# EAGLE design OLED Display (EAGLE 9.6.2)
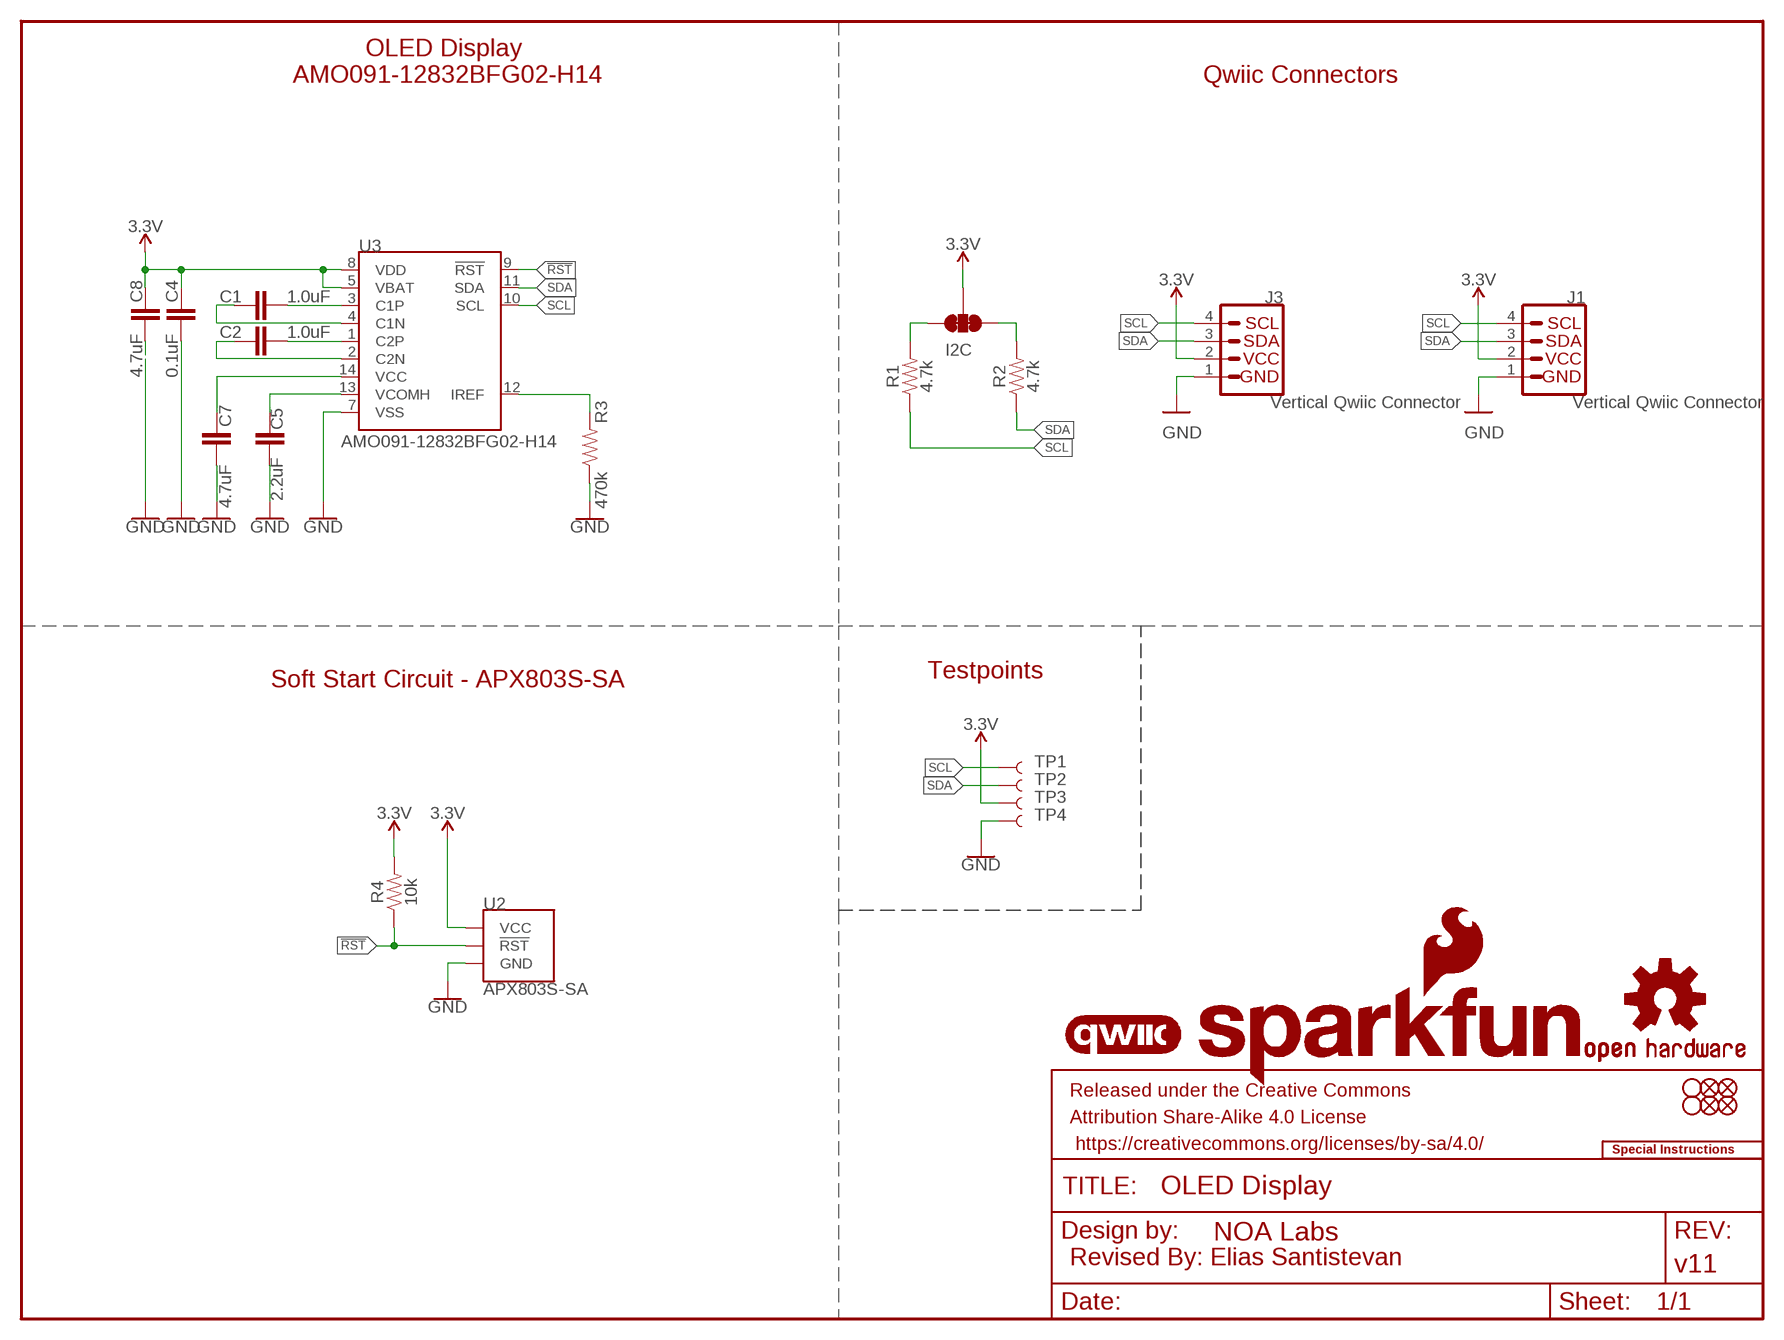
[diagram p0: schematic, sheet 1]

## Parts
C1  1.0uF  1.0UF-0603-16V-10%  [0603]
C2  1.0uF  1.0UF-0603-16V-10%  [0603]
C4  0.1uF  0.1UF-0603-25V-(+80/-20%)  [0603]
C5  2.2uF  2.2UF-0603-10V-20%  [0603]
C7  4.7uF  4.7UF-0603-6.3V-(10%)  [0603]
C8  4.7uF  4.7UF-0603-6.3V-(10%)  [0603]
FD1  FIDUCIAL1X2  [FIDUCIAL-1X2]
FD2  FIDUCIAL1X2  [FIDUCIAL-1X2]
FD3  FIDUCIAL1X2  [FIDUCIAL-1X2]
FD4  FIDUCIAL1X2  [FIDUCIAL-1X2]
FRAME2  FRAME-LETTER  [CREATIVE_COMMONS]
H1  STAND-OFFTIGHT  [STAND-OFF-TIGHT]
H2  STAND-OFFTIGHT  [STAND-OFF-TIGHT]
I2C  JUMPER-SMT_3_2-NC_TRACE_SILK  [SMT-JUMPER_3_2-NC_TRACE_SILK]
J1  Vertical Qwiic Connector  QWIIC_CONNECTOR  [JST04_1MM_VERT]
J3  Vertical Qwiic Connector  QWIIC_CONNECTOR  [JST04_1MM_VERT]
LOGO1  SFE_LOGO_NAME_FLAME.1_INCH  [SFE_LOGO_NAME_FLAME_.1]
LOGO2  OSHW-LOGOMINI  [OSHW-LOGO-MINI]
LOGO3  QWIIC_LOGO_4MM  [QWIIC_4MM]
LOGO4  SPECIAL_INSTRUCTIONS-ORDERING  [ORDERING_INSTRUCTIONS]
R1  4.7k  4.7KOHM-0603-1/10W-1%  [0603]
R2  4.7k  4.7KOHM-0603-1/10W-1%  [0603]
R3  470k  470KOHM  [0603]
R4  10k  10KOHM-0603-1/10W-1%  [0603]
TP1  TEST-POINT3X4  [PAD.03X.04]
TP2  TEST-POINT3X4  [PAD.03X.04]
TP3  TEST-POINT3X4  [PAD.03X.04]
TP4  TEST-POINT3X4  [PAD.03X.04]
U2  APX803S-SA  [SOT23-3]
U3  AMO091-12832BFG02-H14  [AMO091-12832BFG02-H14]

## Nets
3.3V: C4.1 C8.2 I2C.2 J1.2 J3.2 R4.2 TP3.1 U2.3(VCC) U3.5(VBAT) U3.8(VDD)
!RST!: R4.1 U2.2(!RST!) U3.9(!RST!)
GND: C4.2 C5.2 C7.1 C8.1 J1.1 J3.1 R3.1 TP4.1 U2.1(GND) U3.7(VSS)
N$1: C2.2 U3.1(C2P)
N$2: C1.1 U3.4(C1N)
N$4: C1.2 U3.3(C1P)
N$5: I2C.3 R1.2
N$6: C5.1 U3.13(VCOMH)
N$7: C7.2 U3.14(VCC)
N$8: I2C.1 R2.2
N$9: R3.2 U3.12(IREF)
N$17: C2.1 U3.2(C2N)
SCL: J1.4 J3.4 R1.1 TP1.1 U3.10(SCL)
SDA: J1.3 J3.3 R2.1 TP2.1 U3.11(SDA)

## Notes on the sheet
- OLED Display 
  AMO091-12832BFG02-H14
- Qwiic Connectors
- Soft Start Circuit - APX803S-SA | Testpoints
- Revised By: Elias Santistevan

## Library data of the parts
C1 C2 = SparkFun-Capacitors:1.0UF: 1µF ceramic capacitors A capacitor is a passive two-terminal electrical component used to store electrical energy temporarily in an electric field.; PROD_ID: CAP-00868
C4 = SparkFun-Capacitors:0.1UF: 0.1µF ceramic capacitors A capacitor is a passive two-terminal electrical component used to store electrical energy temporarily in an electric field.; PROD_ID: CAP-00810
C5 = SparkFun-Capacitors:2.2UF: 2.2µF ceramic capacitors A capacitor is a passive two-terminal electrical component used to store electrical energy temporarily in an electric field.; PROD_ID: CAP-07888
C7 C8 = SparkFun-Capacitors:4.7UF: 4.7µF ceramic capacitors A capacitor is a passive two-terminal electrical component used to store electrical energy temporarily in an electric field.; PROD_ID: CAP-08280
FD1-FD4 = SparkFun-Aesthetics:FIDUCIAL: Fiducial Alignment Points Point-of-reference for pick-and-place machines and other optical instruments.
FRAME2 = SparkFun-Aesthetics:FRAME-LETTER: Schematic Frame - Letter Standard 8.5x11 US Letter frame; DESIGNER: NOA Labs; REV: v11
H1 H2 = SparkFun-Hardware:STAND-OFF: Stand Off Drill holes for mechanically mounting via screws, standoffs, etc. Note: Use the keepout ring to avoid running the screw head into surrounding components. Variant Overviews STAND-OFF - Mechanical footprint for a #4 phillips button head screw. STAND-OFF-TIGHT - Mechanical footprint for a #4 phillips button head screw, Example SparkFun Products Screw - Phillips Head (1/4", 4-40, 10 pack) <https://www.sparkfun.com/products/10453> (PRT-10453) Screw - Phillips Head (1/2", 4-40, 10 pack) <https://www.sparkfun.com/products/10452> (PRT-10452) Screw - Phillips Head (3/4", 4-40, 10 pack) <https://www.sparkfun.com/products/10451> (PRT-10451) Screw - Phillips Head (1", 4-40, 10 pack) <https://www.sparkfun.com/products/10450> (PRT-10450)
I2C = SparkFun-Jumpers:JUMPER-SMT_3_2-NC_TRACE: Normally closed trace jumper (2 of 2 connections) This jumper has a trace between all three pads so they are normally closed (NC). Use a razor knife to open the connection(s). For best results follow the IPC guidelines for cutting traces: Cutout at least 0.063 mm (0.005 in). Remove all loose material to clean up the cut area. Seal the cut with an approved epoxy. Reapply solder to reclose the connection(s).
J1 J3 = SparkFun-Connectors:QWIIC_CONNECTOR: SparkFun I2C Standard Qwiic Connector An SMD 1mm pitch JST connector makes it easy and quick (get it? Qwiic?) to connect I2C devices to each other. The Qwiic system <http://www.sparkfun.com/qwiic> enables fast and solderless connection between popular platforms and various sensors and actuators. We carry 200mm <https://www.sparkfun.com/products/14204>, 100mm <https://www.sparkfun.com/products/14205>, 50mm <https://www.sparkfun.com/products/14206>, and breadboard friendly <https://www.sparkfun.com/products/14207> Qwiic cables. We also offer 10 pcs strips <https://www.sparkfun.com/products/14323> the SMD connectors.; PROD_ID: CONN-14483
LOGO1 = SparkFun-Aesthetics:SFE_LOGO_NAME_FLAME: SparkFun Font Logo w/ Flame This is the SparkFun full logo. The logo on the schematic will always be the same size; the package variant is the height of the flame part of the logo. Default layer for the logo on the board is tSilk.
LOGO2 = OSHW-LOGO-M:OSHW-LOGO: Open-Source Hardware (OSHW) Logo This logo indicates the piece of hardware it is found on incorporates a OSHW license and/or adheres to the definition of open source hardware found here: http://freedomdefined.org/OSHW
LOGO3 = SparkFun-Aesthetics:QWIIC_LOGO: Qwiic Logos for placement on schematic and PCB. The 5.5mm silk logo is best for placing next to Qwiic connector.
LOGO4 = SparkFun-Aesthetics:SPECIAL_INSTRUCTIONS: Special Ordering/Production Instructions Alert Symbol for special PCB ordering instructions or unique production process warnings. Ordering Instructions Production Instructions Types of information that should be added to box: Copper weight Soldermask color Silk color PCB thickness Number of layers PCB Standard: 1.6mm FR4 1 oz copper immersion silver plating red soldermask white silkscreen Types of information that should be added to box: Special wash requirements Depaneling instructions Humidification Glue curing Default text settings: 0.07 inch 9% ratio 50% line distance
R1 R2 = SparkFun-Resistors:4.7KOHM: 4.7kΩ resistor A resistor is a passive two-terminal electrical component that implements electrical resistance as a circuit element. Resistors act to reduce current flow, and, at the same time, act to lower voltage levels within circuits. - Wikipedia; PROD_ID: RES-07857
R3 = SparkFun-Resistors:470KOHM; PROD_ID: RES-16181
R4 = SparkFun-Resistors:10KOHM: 10kΩ resistor A resistor is a passive two-terminal electrical component that implements electrical resistance as a circuit element. Resistors act to reduce current flow, and, at the same time, act to lower voltage levels within circuits. - Wikipedia; PROD_ID: RES-00824
TP1-TP4 = SparkFun-Connectors:TEST-POINT: SparkFun Test Points Bare copper test points for troubleshooting or In-Circuit-Testing. These are used by our Production team for verifying production board runs using pogo-pins on test beds. SparkFun Products: SparkFun LSM9DS1 Breakout <https://www.sparkfun.com/products/13284> SparkFun PSOC <https://www.sparkfun.com/products/13714> SparkFun Load Cell Amplifier <https://www.sparkfun.com/products/13879>
U2 = Module:APX803S-SA: DIODES - APX803S-SA The APX803S is used for microprocessor (μP) supervisory circuits to monitor the power supplies in μP and digital systems. They provide excellent circuit reliability and low cost by eliminating external components and adjustments when used with 5.0V, 3.3V, 3.0V and 2.5V powered circuits. These circuits perform a single function: they assert a reset signal on power up and whenever the V CC supply voltage declines below a preset threshold, keeping it asserted for a fixed period of time after V CC has risen above the reset threshold. For the APX803S this period is a minimum of 1ms while for other APX803S variants it is at least 140ms. The reset comparator is designed to ignore fast transients on V CC, and the outputs are guaranteed to be in the correct logic state for V CC down to 1V; PROD_ID: IC-21146
U3 = Module:AMO091-12832BFG02-H14; PROD_ID: LCD-21145

## Board
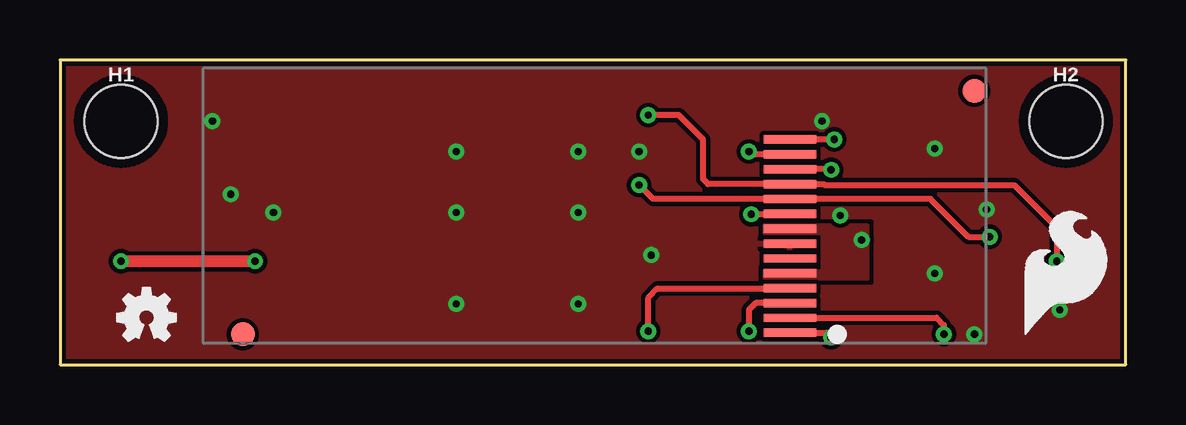
[diagram p1: board, top side]
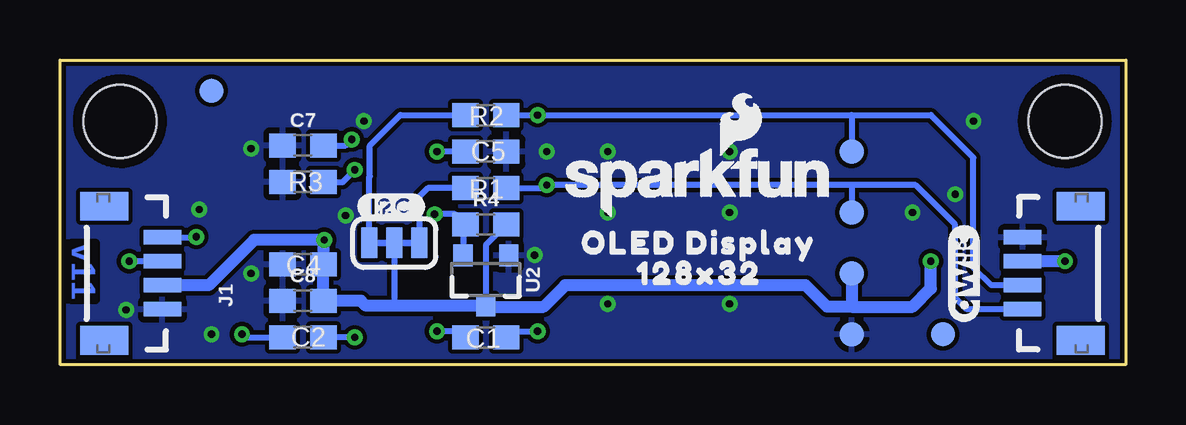
[diagram p2: board, bottom side, seen from below]

Size 44.41 x 12.71 mm. Coordinates in mm from the lower left corner, seen from the top.
Outline: 0,0 44.41,0 44.41,12.71 0,12.71 0,0
Copper layers (1*16): Top 0.035mm / dielectric 1.5mm / Bottom 0.035mm
Design rules "SparkFun-2-Layer-General-JLCPCB": minimum track width 7mil, minimum drill 0.3mm, track to track 7mil, track to pad 7mil, pad to pad 7mil, via to via 7mil, smd to smd 7mil, copper to edge 7mil, drill to drill 7mil, minimum pad ring 7mil, minimum via ring 7mil, stop-mask expansion 3mil, vias tented up to drill 25mil, thermal gap 10mil

### Footprints (pad centres in the part's own frame; a part is rotated, then mirrored left to right if it is on the bottom)
0603 = smd 1.1 x 1: 1 -0.85,0; 2 0.85,0
FIDUCIAL-1X2 = smd 1 x 1: 1 0,0
STAND-OFF-TIGHT = hole 3.048: 0,0
SMT-JUMPER_3_2-NC_TRACE_SILK = smd 0.66 x 1.27: 1 -1.041,0; 2 0,0; 3 1.041,0
JST04_1MM_VERT = smd 0.6 x 1.55: 1 -1.5,0.775; 2 -0.5,0.775; 3 0.5,0.775; 4 1.5,0.775 | smd 1.2 x 2: NC1 -2.8,3.2; NC2 2.8,3.2
PAD.03X.04 = smd 1.016 x 1.016: 1 0,0
SOT23-3 = smd 0.8 x 0.9: 1 -0.95,-1; 2 0.95,-1; 3 0,1.1
AMO091-12832BFG02-H14 = smd 2.2 x 0.35: 1 -0.066,-3.746; 2 -0.066,-3.126; 3 -0.066,-2.506; 4 -0.066,-1.886; 5 -0.066,-1.266; 6 -0.066,-0.646; 7 -0.066,-0.026; 8 -0.066,0.594; 9 -0.066,1.214; 10 -0.066,1.834; 11 -0.066,2.454; 12 -0.066,3.074; 13 -0.066,3.694; 14 -0.066,4.314

### Placement (x,y rotation side)
C1  26.67,1.14 180 bottom
C2  34.29,1.14 0 bottom
C4  34.29,4.19 180 bottom
C5  26.67,8.89 0 bottom
C7  34.29,9.14 0 bottom
C8  34.29,2.67 0 bottom
FD1  7.62,1.27 0 top
FD2  7.62,1.27 0 bottom
FD3  38.1,11.43 0 top
FD4  38.1,11.43 0 bottom
FRAME2  1.22,-14.38 0 top  (outside the outline)
H1  2.54,10.16 0 top
H2  41.91,10.16 0 top
I2C  30.48,5.08 0 bottom
J1  39.37,3.81 90 bottom
J3  5.08,3.81 270 bottom
LOGO1  17.78,7.62 0 bottom
LOGO2  3.61,1.98 0 top
LOGO3  6.73,3.81 90 bottom
LOGO4  57.4,50.67 0 top  (outside the outline)
R1  26.67,7.37 180 bottom
R2  26.67,10.41 180 bottom
R3  34.29,7.62 0 bottom
R4  26.67,5.84 0 bottom
TP1  11.43,6.35 0 bottom
TP2  11.43,8.89 0 bottom
TP3  11.43,3.81 0 bottom
TP4  11.43,1.27 0 bottom
U2  26.67,3.56 180 bottom
U3  30.48,5.08 0 top
U$1  [SFE_LOGO_FLAME_.2]  41.91,3.81 0 top
U$2  [OLED_DISPLAY94]  17.78,5.08 0 bottom
U$3  [128X3295]  17.78,3.81 0 bottom
U$4  [#I2C#16]  30.61,6.6 0 bottom

### Tracks (layer width: path | path; a pad name or v marks a point on that pad's centre or on a via)
3.3V  (via drill 0.3)
  Top 0.508: v8.13,4.32 v2.54,4.32
  Bottom 0.254: R4.2 26.67,4.99 U2.3 | I2C.2 30.48,2.46
  Bottom 0.508: 11.43,2.41 12.45,2.41 13.34,3.31 23.36,3.31 24.26,2.41 26.63,2.41 U2.3 30.48,2.46 31.67,2.46 31.88,2.67 C8.2 C4.1 33.44,5.17 v33.4,5.21 36.32,5.21 38.22,3.31 J1.2 | TP3.1 11.43,2.41 | 11.43,2.41 8.89,2.41 8.13,3.17 v8.13,4.32 | v2.54,4.32 v2.55,4.31 J3.2
  pour Top (no thermals): 29.34,3.94 31.75,3.94 31.75,5.46 29.34,5.46 29.34,5.84 33.66,5.84 33.66,3.56 29.34,3.56
!RST!  (via drill 0.3)
  Top 0.254: v28.8,6.28 U3.9
  Bottom 0.254: U2.2 27.62,5.74 R4.1 27.96,6.28 v28.8,6.28
GND  (via drill 0.3)
  other vias: 6.35,10.16 7.11,7.11 16.51,8.89 21.59,8.89 24.13,8.89 8.89,6.35 16.51,6.35 21.59,6.35 16.51,2.54 21.59,2.54 31.75,10.16 38.61,6.48 38.1,1.27 36.45,9.02 36.45,3.81 24.64,4.57 32.51,6.22 41.66,2.29
  pour Top (rank 4): 0,0 44.4,0 44.4,12.7 0,12.7
  pour Bottom (rank 4): 0,0 44.42,0 44.42,12.7 0,12.7
N$1  (via drill 0.3)
  Top 0.254: U3.1 31.94,1.33 v32.13,1.14
  Bottom 0.254: v32.13,1.14 C2.2
N$2  (via drill 0.3)
  Top 0.254: v24.51,1.4 24.51,2.79 24.89,3.17 30.39,3.17 U3.4
  Bottom 0.254: C1.1 25.57,1.4 v24.51,1.4
N$4  (via drill 0.3)
  Top 0.254: v28.7,1.4 28.7,2.29 28.99,2.57 U3.3
  Bottom 0.254: C1.2 27.77,1.4 v28.7,1.4
N$5
  Bottom 0.254: R1.2 29.08,7.37 29.44,7.01 I2C.3
N$6  (via drill 0.3)
  Top 0.254: U3.13 28.82,8.77 v28.7,8.89
  Bottom 0.254: C5.1 v28.7,8.89
N$7  (via drill 0.3)
  Top 0.254: v32.26,9.4 v32.25,9.39 U3.14
  Bottom 0.254: C7.2 32.51,9.14 v32.26,9.4
N$8
  Bottom 0.254: R2.2 30.23,10.41 31.5,9.14 31.5,7.87 31.52,7.84 I2C.1
N$9  (via drill 0.3)
  Top 0.254: v32.13,8.13 32.1,8.15 U3.12
  Bottom 0.254: R3.2 32.64,7.62 v32.13,8.13
N$17  (via drill 0.3)
  Top 0.254: U3.2 36.53,1.95 36.83,1.65 v36.83,1.27
  Bottom 0.254: v36.83,1.27 36.7,1.14 C2.1
SCL  (via drill 0.3)
  Top 0.254: v38.73,5.33 37.85,5.33 36.27,6.91 U3.10 24.71,6.91 v24.13,7.49
  Bottom 0.254: 11.43,7.49 8.76,7.49 7.11,5.84 7.11,2.79 6.63,2.31 J3.4 | 11.43,7.49 v24.13,7.49 24.26,7.37 R1.1 | 11.43,7.49 TP1.1 | J1.4 38.76,5.31 v38.73,5.33
SDA  (via drill 0.3)
  Top 0.254: v41.53,4.32 41.53,5.71 39.75,7.49 31.87,7.49 31.83,7.53 U3.11 27.01,7.53 26.8,7.75 26.8,9.4 25.78,10.41 v24.51,10.41
  Bottom 0.254: R2.1 v24.51,10.41 11.43,10.41 | 11.43,10.41 8.13,10.41 6.35,8.64 6.35,4.06 5.6,3.31 J3.3 | 11.43,10.41 TP2.1 | J1.3 40.15,4.32 v41.53,4.32

### Text on the board
Bottom: v11
bPlace: C:/Users/NOA-01/Documents/eagle/Eagle/ulp/logo/NOA Logo - for Screen - 1000x435 + White Background Mirror.bmp
Measures: Units in Inches
tDocu: 1.6mm Thickness / 1 oz. Copper / Lead-Free HASL finish / Material: TG135-140 / Red Soldermask / White Silkscreen / Two Layer | NOA Labs | Revised By: Elias Santistevan